# Altium schematic sheet 7_Mosfets.SchDoc: Mosfets
size A4; ApprovedBy: Alcatraz; CheckedBy: Alcatraz; Author: Alcatraz; CompanyName: DHNLAB; DrawnBy: Alcatraz; Engineer: Alcatraz; Organization: DHNLAB PVT LTD; Address1: DHANBAD; Address2: JHARKHAND; Address3: INDIA; Address4: ASIA; DocumentNumber: 7; Revision: 1.0; SheetNumber: 7; SheetTotal: 10; ProjectTitle: ESP8266-Deskop_Power
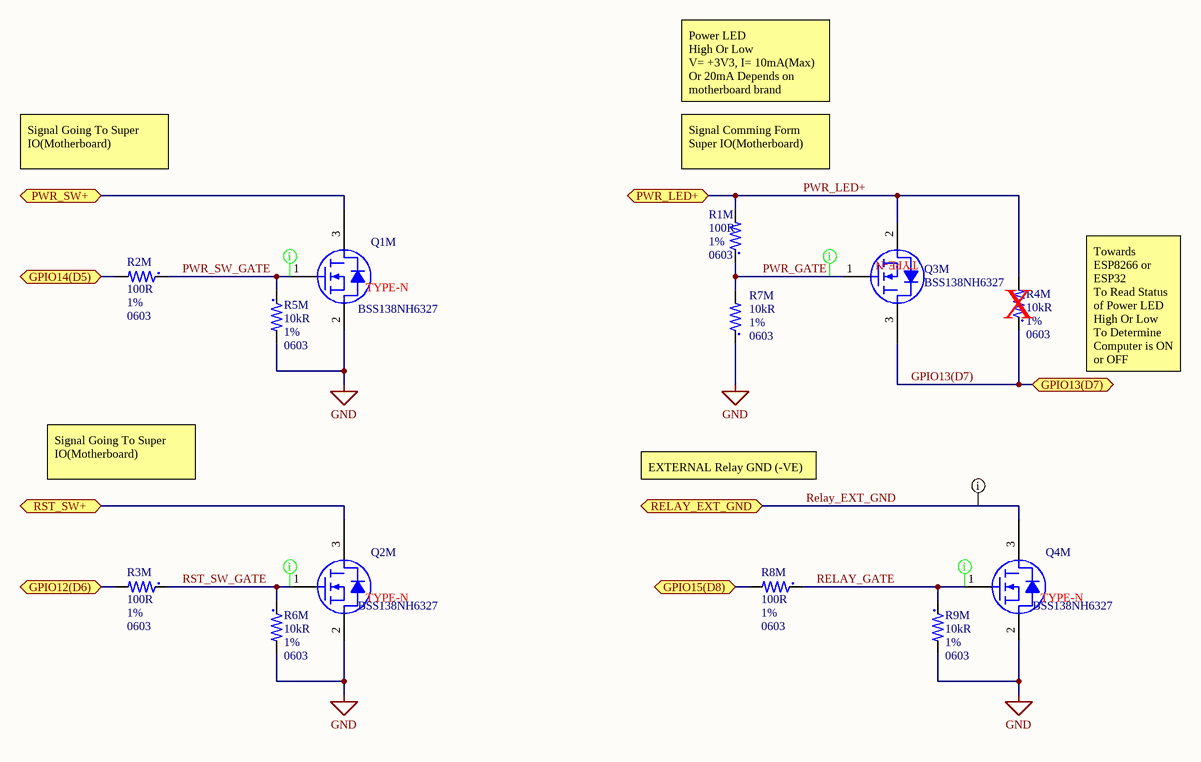
[diagram p0: 7_Mosfets.SchDoc]

## Parts
Q1M  BSS138NH6327  [SOT-23-3-IPC_C]
Q2M  BSS138NH6327  [SOT-23-3-IPC_C]
Q3M  BSS138NH6327  [SOT-23-3-IPC_C]
Q4M  BSS138NH6327  [SOT-23-3-IPC_C]
R1M  value 100R  Tolerance: 1%  Case/Package: 0603  [R0603-MFG]  (hidden comment: AC0603FR-07100RL)
R2M  value 100R  Tolerance: 1%  Case/Package: 0603  [R0603-MFG]  (hidden comment: AC0603FR-07100RL)
R3M  value 100R  Tolerance: 1%  Case/Package: 0603  [R0603-MFG]  (hidden comment: AC0603FR-07100RL)
R4M  value 10kR  Tolerance: 1%  Case/Package: 0603  [R0603-MFG]  (hidden comment: RC0603FR-0710KL)
R5M  value 10kR  Tolerance: 1%  Case/Package: 0603  [R0603-MFG]  (hidden comment: RC0603FR-0710KL)
R6M  value 10kR  Tolerance: 1%  Case/Package: 0603  [R0603-MFG]  (hidden comment: RC0603FR-0710KL)
R7M  value 10kR  Tolerance: 1%  Case/Package: 0603  [R0603-MFG]  (hidden comment: RC0603FR-0710KL)
R8M  value 100R  Tolerance: 1%  Case/Package: 0603  [R0603-MFG]  (hidden comment: AC0603FR-07100RL)
R9M  value 10kR  Tolerance: 1%  Case/Package: 0603  [R0603-MFG]  (hidden comment: RC0603FR-0710KL)

## Ports
GPIO12(D6) (bidir, see 3_ESP8266_Core[4B]), GPIO13(D7) (bidir, see 3_ESP8266_Core[4B]), GPIO14(D5) (bidir, see 3_ESP8266_Core[4B]), GPIO15(D8) (bidir, see 3_ESP8266_Core[2B]), PWR_LED+ (bidir, see 3_ESP8266_Core[4B]), PWR_SW+ (bidir, see 3_ESP8266_Core[4B]), RELAY_EXT_GND (bidir, see 3_ESP8266_Core[4B]), RST_SW+ (bidir, see 3_ESP8266_Core[4B])

## Nets
GND: Q1M.2(S) Q2M.2(S) Q4M.2(S) R5M.2 R6M.2 R7M.1 R9M.2
GPIO12(D6): R3M.2 ; port GPIO12(D6)
GPIO13(D7): Q3M.3(D) R4M.1 ; port GPIO13(D7)
GPIO14(D5): R2M.2 ; port GPIO14(D5)
GPIO15(D8): R8M.2 ; port GPIO15(D8)
PWR_GATE: Q3M.1(G) R1M.1 R7M.2
PWR_LED+: Q3M.2(S) R1M.2 R4M.2 ; port PWR_LED+
PWR_SW+: Q1M.3(D) ; port PWR_SW+
PWR_SW_GATE: Q1M.1(G) R2M.1 R5M.1
Relay_EXT_GND: Q4M.3(D) ; port RELAY_EXT_GND
RELAY_GATE: Q4M.1(G) R8M.1 R9M.1
RST_SW+: Q2M.3(D) ; port RST_SW+
RST_SW_GATE: Q2M.1(G) R3M.1 R6M.1

## Layout directives
net class Digital_Signal_Low_Speed; net class Signal: PWR_GATE, PWR_SW_GATE, RELAY_GATE, RST_SW_GATE
net class GND; net class PowerRails_GND: Relay_EXT_GND

## Notes on the sheet
- Power LED
  High Or Low
  V= +3V3, I= 10mA(Max) Or 20mA Depends on motherboard brand
- Signal Going To Super IO(Motherboard)
- Signal Comming Form Super IO(Motherboard)
- (near R4M) X
- Towards ESP8266 or ESP32
  To Read Status
  of Power LED
  High Or Low
  To Determine
  Computer is ON or OFF
- EXTERNAL Relay GND (-VE)
- Title:
- Author:
- Approved:
- Size:
- Date:
- Git Hash:
- A4
- Prj:
- SW Version:
- Variant:
- Edited:
- PUBLIC
- File:
- (in symbol BSS138NH6327) TYPE-N

## Library data of the parts
Q1M Q2M Q3M Q4M = BSS138NH6327: Single N-Channel 60 V 3.5 Ohm 1 nC SIPMOS® Small Signal Mosfet - SOT-23; Manufacturer: Infineon; Rds On Max: 3.5R; Continuous Drain Current (ID): 230mA; Max Power Dissipation: 360mW; Input Capacitance: 41pF; Drain to Source Voltage (Vdss): 60V; Turn-Off Delay Time: 6.7ns; Turn-On Delay Time: 2.3ns; Threshold Voltage: 1V; Gate to Source Voltage (Vgs): 20V; Voltage: 50V; Rise Time: 3ns; Fall Time: 8.2ns; Supplier 1: Mouser; Manufacturer Part Number: BSS138NH6327; RoHS: Yes; Stock 1: 795876; Pricing 1: 1=0.37, 10=0.281, 50=0.281, 100=0.159, 1000=0.081, 10000=0.056 (USD); Mounting Technology: Surface Mount; Case/Package: TO-236-3; Pins: 3; Min Operating Temperature: -55°C; Max Operating Temperature: 150°C; Packaging: Tape and Reel; Package Quantity: 3000; Series: SIPMOS®; Length: 2.9mm; Width: 1.3mm; Height: 1mm; RoHS Compliant: Yes; Reach SVHC Compliant: No; Supplier Part Number 1: 726-BSS138NH6327
R1M R2M R3M R8M = 100R: SMD Chip Resistor, 100 Ohm, ± 1%, 100 mW, 0603 [1608 Metric], Thick Film, General Purpose; Manufacturer: Yageo; Power Rating: 100mW; Voltage Rating: 50V; Temperature Coefficient: 100ppm/°C; Supplier 1: Future Electronics; Manufacturer Part Number: AC0603FR-07100RL; RoHS: Yes; Category: Chip SMD Resistors; Stock 1: 1675000; Pricing 1: 5000=0.0027, 50000=0.0025, 150000=0.0024, 375000=0.0023, 1000000=0.0022 (USD); Case Code (Metric): 1608; Min Operating Temperature: -55°C; Max Operating Temperature: 155°C; Packaging: Tape and Reel; Height: 0.45mm; RoHS Compliant: Yes; ComponentLink1URL: https://datasheet.ciiva.com/12576/pyu-ac-51-rohs-l-2-12576586.pdf?src-supplier=Mouser; ComponentLink1Description: https://datasheet.ciiva.com/12576/pyu-ac-51-rohs-l-2-12576586.pdf?src-supplier=Mouser; Supplier Part Number 1: 2026405; Contact Plating: Tin,Matte; Case Code (Imperial): 0603; Series: AC; Termination: SMD/SMT; Length: 1.6mm; Width: 0.8mm; Weight: 7.1E-05oz; Number of Terminations: 2; Max Power Dissipation: 100mW; Features: Moisture Resistant,Automotive AEC-Q200; Ratings: AEC-Q200; Lead Free: 5697LeadFree
R4M R7M = 10K: SMD Chip Resistor, 10 kOhm, ± 1%, 100 mW, 0603 [1608 Metric], Thick Film, General Purpose; Manufacturer: Yageo; Power Rating: 100mW; Voltage Rating: 75V; Temperature Coefficient: 100ppm/°C; Voltage Rating (DC): 50V; Supplier 1: Future Electronics; Manufacturer Part Number: RC0603FR-0710KL; RoHS: Yes; Category: Chip SMD Resistors; Stock 1: 44660000; Pricing 1: 5000=0.0015, 50000=0.0014, 150000=0.0014, 375000=0.0013, 1000000=0.0012 (USD); Case Code (Metric): 1608; Min Operating Temperature: -55°C; Max Operating Temperature: 155°C; Packaging: Tape and Reel; Height: 0.45mm; RoHS Compliant: Yes; Supplier Part Number 1: 4023214; Lead Free: 5697LeadFree; Case Code (Imperial): 0603; Series: RC; Termination: SMD/SMT; Construction: Rectangular; Length: 1.6mm; Width: 0.8mm; Depth: 0.8mm; Military Standard: Not; Pins: 2; Weight: 7.1E-05oz; Resistance Tolerance: 1%; Resistor Type: Thick Film; Max Power Dissipation: 100mW; Features: Moisture Resistant; Number of Terminations: 2; Lead Pitch: 0.3mm; Reach SVHC Compliant: No
R5M R6M R9M = 10K: SMD Chip Resistor, 10 kOhm, ± 1%, 100 mW, 0603 [1608 Metric], Thick Film, General Purpose; Manufacturer: Yageo; Power Rating: 100mW; Temperature Coefficient: 100ppm/°C; Voltage Rating (DC): 50V; Voltage Rating: 75V; Supplier 1: Future Electronics; Manufacturer Part Number: RC0603FR-0710KL; RoHS: Yes; Category: Chip SMD Resistors; Stock 1: 44660000; Pricing 1: 5000=0.0015, 50000=0.0014, 150000=0.0014, 375000=0.0013, 1000000=0.0012 (USD); Case Code (Imperial): 0603; Case Code (Metric): 1608; Min Operating Temperature: -55°C; Max Operating Temperature: 155°C; Packaging: Tape and Reel; Series: RC; Termination: SMD/SMT; Construction: Rectangular; Length: 1.6mm; Width: 0.8mm; Height: 0.45mm; Depth: 0.8mm; RoHS Compliant: Yes; Military Standard: Not; Lead Free: 5697LeadFree; Supplier Part Number 1: 4023214; Pins: 2; Weight: 7.1E-05oz; Resistance Tolerance: 1%; Resistor Type: Thick Film; Max Power Dissipation: 100mW; Features: Moisture Resistant; Number of Terminations: 2; Lead Pitch: 0.3mm; Reach SVHC Compliant: No